# EAGLE design Main (EAGLE 7.7.0)
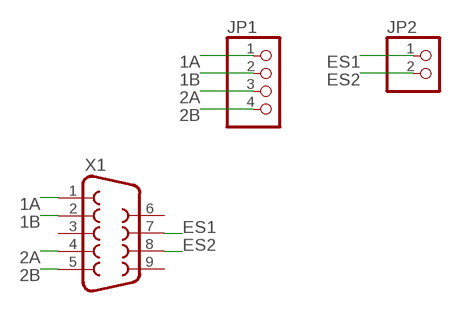
[diagram p0: schematic, sheet 1]

## Parts
JP1  PINHD-1X4  [1X04]
JP2  PINHD-1X2  [1X02]
X1  F09HP  [F09HP]

## Nets
1A: JP1.1 X1.1
1B: JP1.2 X1.2
2A: JP1.3 X1.4
2B: JP1.4 X1.5
ES1: JP2.1 X1.7
ES2: JP2.2 X1.8
Unconnected: X1.3 X1.6 X1.9

## Library data of the parts
JP1 = pinhead:PINHD-1X4: PIN HEADER
JP2 = pinhead:PINHD-1X2: PIN HEADER
X1 = con-subd:F09: SUB-D; OC_FARNELL: unknown; OC_NEWARK: unknown

## Board
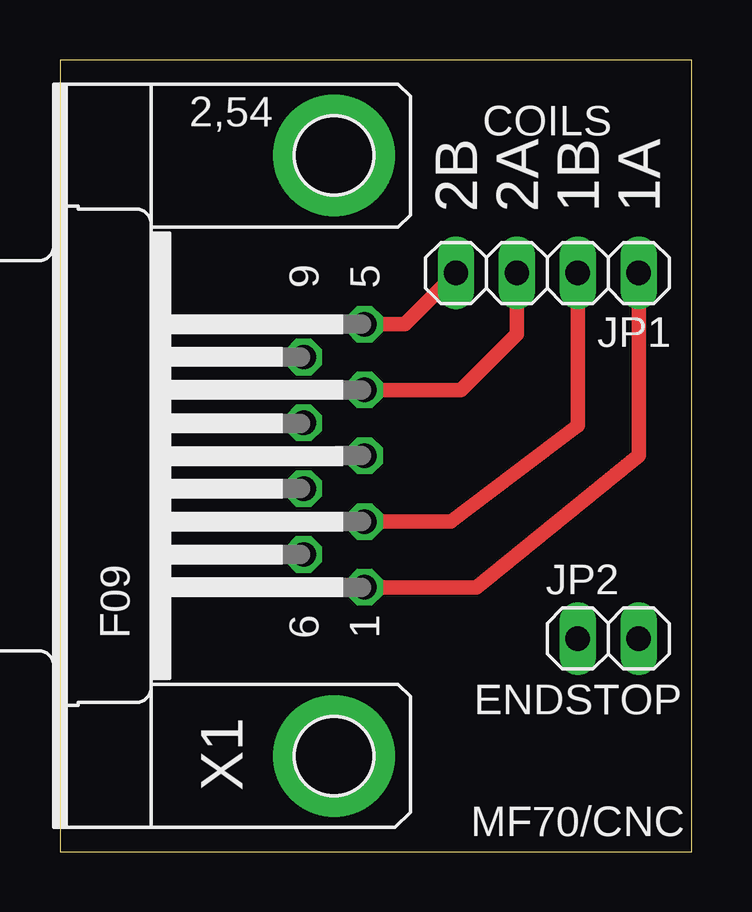
[diagram p1: board, top side]
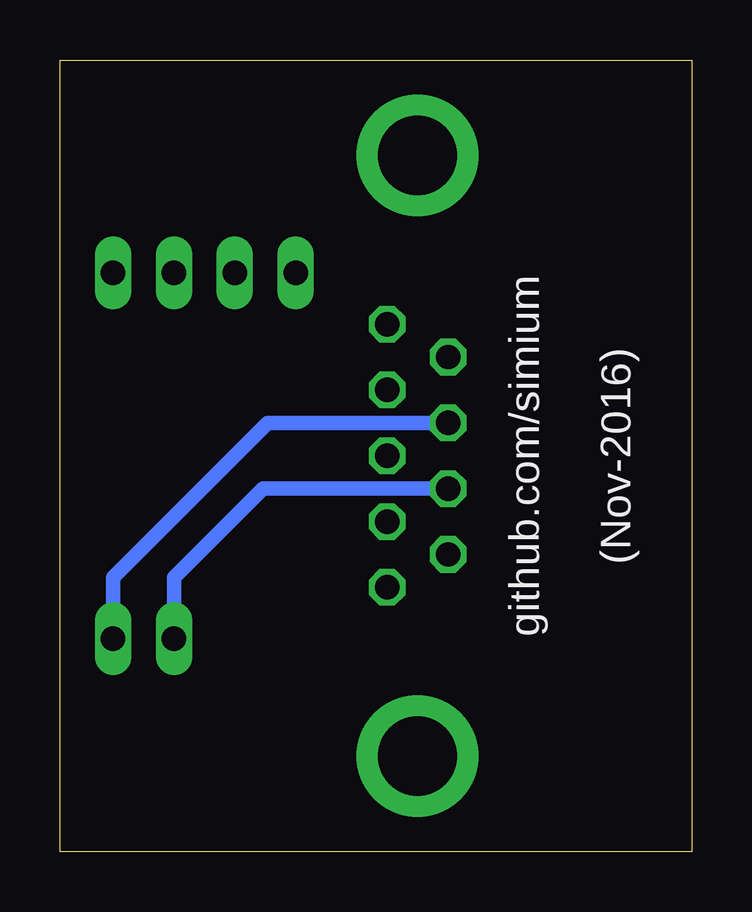
[diagram p2: board, bottom side, seen from below]

Size 26.34 x 33.01 mm. Coordinates in mm from the lower left corner, seen from the top.
Outline: 0,0 26.34,0 26.34,33.01 0,33.01 0,0
Copper layers (1*16): Top 0.0356mm / dielectric 1.5011mm / Bottom 0.0356mm
Design rules "oshpark-2layer": minimum track width 6mil, minimum drill 13mil, track to track 6mil, track to pad 6mil, pad to pad 6mil, via to via 6mil, smd to smd 6mil, copper to edge 15mil, drill to drill 6mil, minimum pad ring 7mil, minimum via ring 7mil, stop-mask expansion 2.5mil, vias tented up to drill 0mil, thermal gap 10mil

### Footprints (pad centres in the part's own frame; a part is rotated, then mirrored left to right if it is on the bottom)
1X04 = drill 1.016 long: 1 -3.81,0; 2 -1.27,0; 3 1.27,0; 4 3.81,0
1X02 = drill 1.016 long: 1 -1.27,0; 2 1.27,0
F09HP = drill 1.016 octagon: 1 -5.486,-1.27; 2 -2.743,-1.27; 3 0,-1.27; 4 2.743,-1.27; 5 5.486,-1.27; 6 -4.115,1.27; 7 -1.372,1.27; 8 1.372,1.27; 9 4.115,1.27 | drill 3.302 pad 5.08: G1 -12.522,0; G2 12.522,0

### Placement (x,y rotation side)
JP1  20.32,24.13 180 top
JP2  22.86,8.89 0 top
X1  11.43,16.51 90 top

### Tracks (layer width: path | path; a pad name or v marks a point on that pad's centre or on a via)
1A
  Top 0.61: X1.1 17.37,11.02 24.13,16.51 JP1.1
1B
  Top 0.61: X1.2 16.31,13.77 21.59,17.78 JP1.2
2A
  Top 0.61: X1.4 16.71,19.25 19.05,21.59 JP1.3
2B
  Top 0.61: X1.5 14.38,22 JP1.4
ES1
  Bottom 0.61: X1.7 17.88,15.14 21.59,11.43 JP2.1
ES2
  Bottom 0.61: X1.8 17.68,17.88 24.13,11.43 JP2.2

### Text on the board
tNames: COILS | 2B | 2A | 1B | 1A | ENDSTOP | MF70/CNC
bNames: github.com/simium / / (Nov-2016)